# EAGLE design ciabatta (EAGLE 4.16)
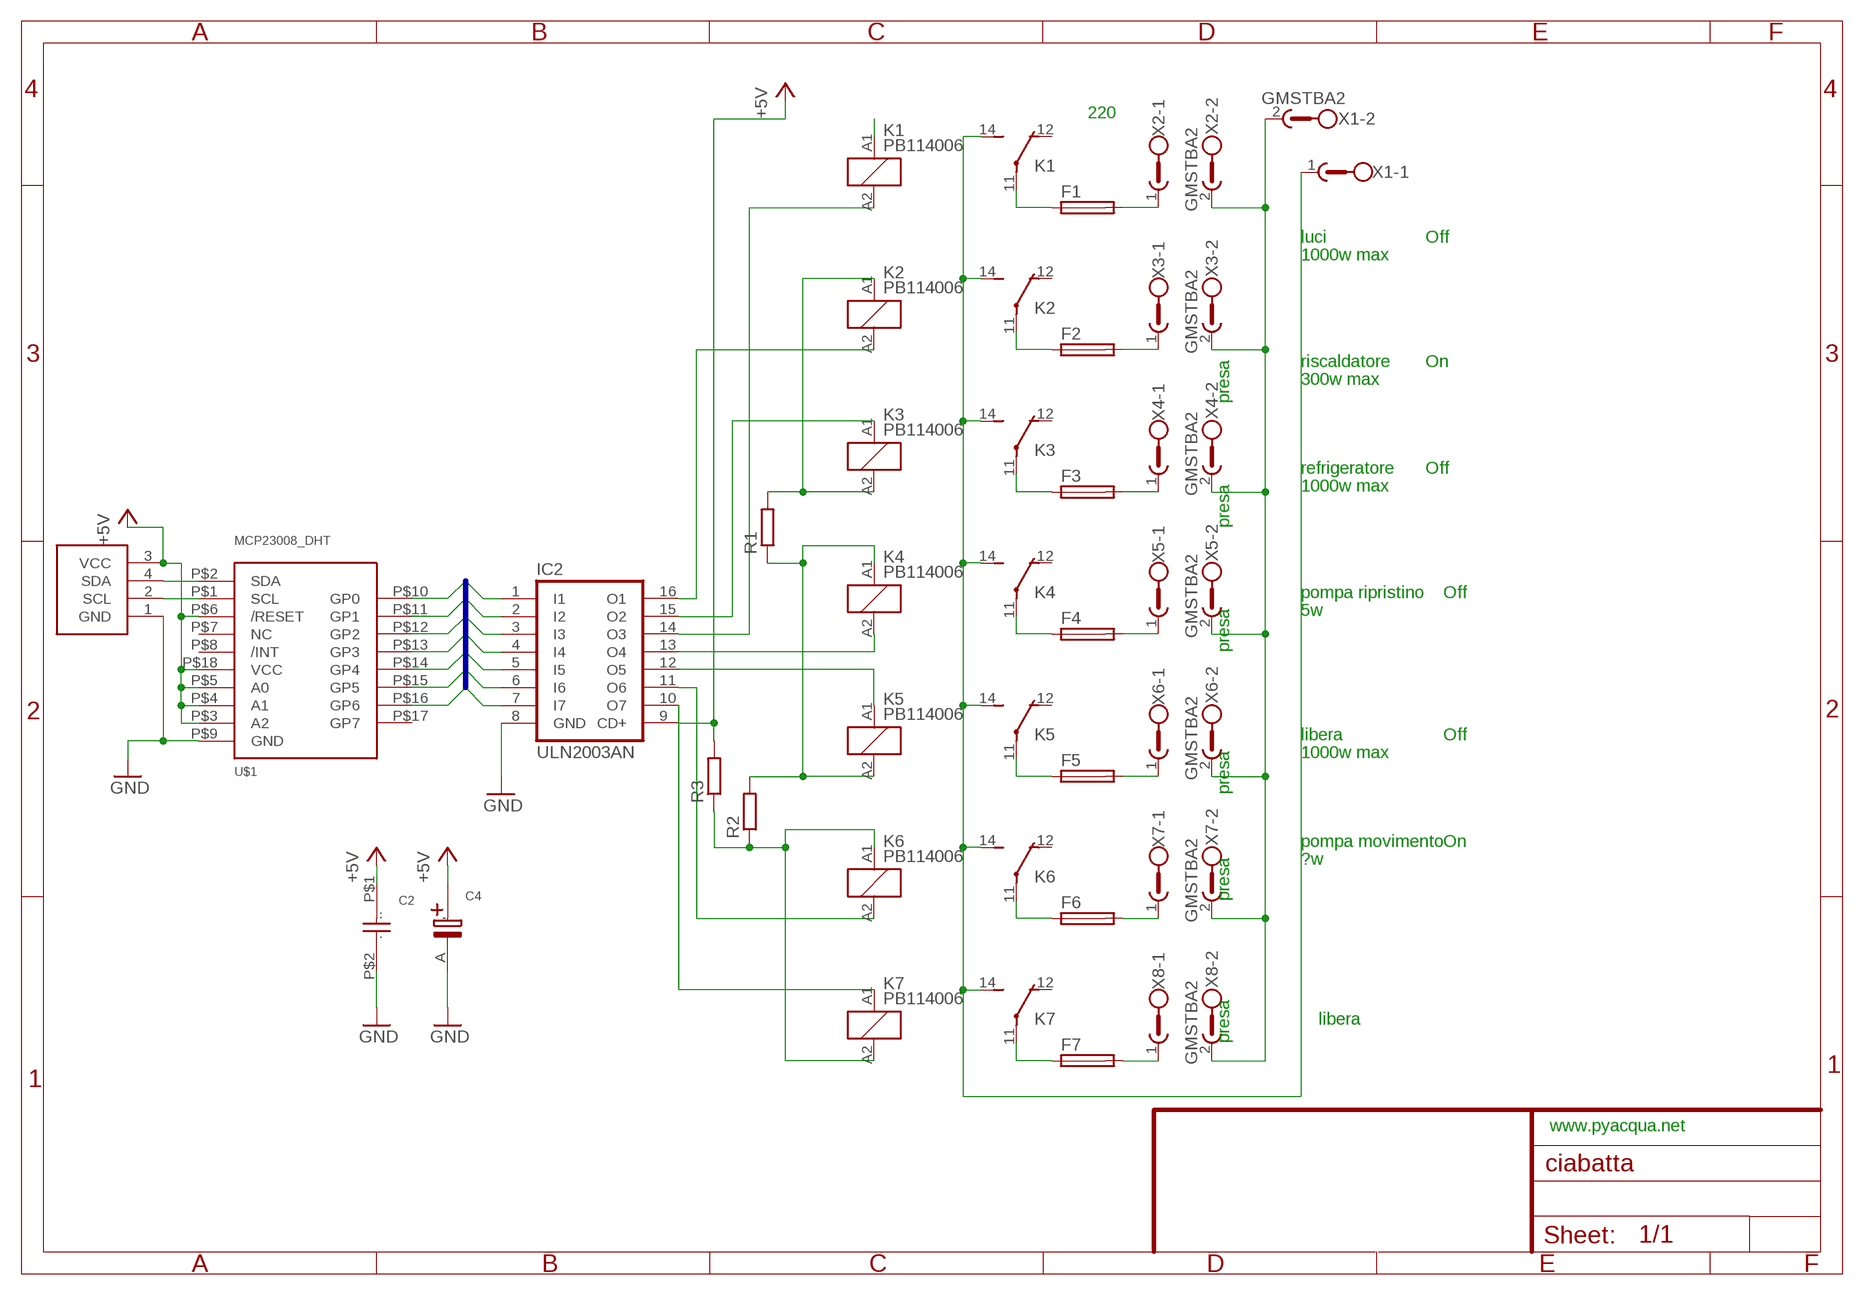
[diagram p0: schematic, sheet 1]

## Parts
C2  CAP_POLI  [CAP_POLI]
C4  CAP_ELET  [CAP_ELET]
F1  SH22,5A  [SH22,5A]
F2  SH22,5A  [SH22,5A]
F3  SH22,5A  [SH22,5A]
F4  SH22,5A  [SH22,5A]
F5  SH22,5A  [SH22,5A]
F6  SH22,5A  [SH22,5A]
F7  SH22,5A  [SH22,5A]
IC2  ULN2003AN  [DIL16]
K1  PB114006  [PB]
K2  PB114006  [PB]
K3  PB114006  [PB]
K4  PB114006  [PB]
K5  PB114006  [PB]
K6  PB114006  [PB]
K7  PB114006  [PB]
R1  R-EU_0207/15  [0207/15]
R2  R-EU_0207/15  [0207/15]
R3  R-EU_0207/7  [0207/7]
U$1  MCP23008_DHT  [MCP23008_DHT]
U$3  J-I2C  [J-I2C]
X1  GMSTBA2  [GMSTBA2]
X2  GMSTBA2  [GMSTBA2]
X3  GMSTBA2  [GMSTBA2]
X4  GMSTBA2  [GMSTBA2]
X5  GMSTBA2  [GMSTBA2]
X6  GMSTBA2  [GMSTBA2]
X7  GMSTBA2  [GMSTBA2]
X8  GMSTBA2  [GMSTBA2]

## Nets
+5V [vcc]: C2.P$1(.) C4.B(.) IC2.9(CD+) R3.2 U$1.P$3(A2) U$1.P$4(A1) U$1.P$5(A0) U$1.P$6(/RESET) U$1.P$18(VCC) U$3.3(VCC)
CH1: K2.A1 K3.A2 R1.2
CH2: IC2.16(O1) K2.A2
CH5: IC2.12(O5) K5.A1
CH6: IC2.11(O6) K6.A2
GND: C2.P$2(..) C4.A(') IC2.8(GND) U$1.P$9(GND) U$3.1(GND)
N$1 [220]: F3.1 K3.11(2:P)
N$2: K1.A1
N$3: U$1.P$1(SCL) U$3.2(SCL)
N$4: U$1.P$2(SDA) U$3.4(SDA)
N$5 [220]: K1.14(2:S) K2.14(2:S) K3.14(2:S) K4.14(2:S) K5.14(2:S) K6.14(2:S) K7.14(2:S) X1.1
N$6 [220]: F7.2 X8.1
N$7 [220]: F6.2 X7.1
N$8 [220]: F5.2 X6.1
N$9 [220]: F2.1 K2.11(2:P)
N$10 [220]: F4.2 X5.1
N$11 [220]: F1.1 K1.11(2:P)
N$12 [220]: F3.2 X4.1
N$13 [220]: F4.1 K4.11(2:P)
N$14 [220]: F2.2 X3.1
N$15 [220]: F5.1 K5.11(2:P)
N$16 [220]: F1.2 X2.1
N$18: IC2.10(O7) K7.A1
N$19 [220]: F7.1 K7.11(2:P)
N$20 [220]: F6.1 K6.11(2:P)
N$21: K6.A1 K7.A2 R2.1 R3.1
N$22: K4.A1 K5.A2 R1.1 R2.2
N$23 [220]: X1.2 X2.2 X3.2 X4.2 X5.2 X6.2 X7.2 X8.2
N$25: IC2.13(O4) K4.A2
N$26: IC2.14(O3) K1.A2
N$27: IC2.15(O2) K3.A1
OUT1: IC2.7(I7) U$1.P$10(GP0)
OUT2: IC2.6(I6) U$1.P$11(GP1)
OUT3: IC2.5(I5) U$1.P$12(GP2)
OUT4: IC2.4(I4) U$1.P$13(GP3)
OUT5: IC2.3(I3) U$1.P$14(GP4)
OUT6: IC2.2(I2) U$1.P$15(GP5)
OUT7: IC2.1(I1) U$1.P$16(GP6)
Unconnected: K1.12(2:O) K2.12(2:O) K3.12(2:O) K4.12(2:O) K5.12(2:O) K6.12(2:O) K7.12(2:O) U$1.P$7(NC) U$1.P$8(/INT) U$1.P$17(GP7)

## Buses
OUT[1..7]

## Notes on the sheet
- 220
- luci | Off
- 1000w max
- riscaldatore | On
- 300w max
- presa
- refrigeratore | Off
- 1000w max
- presa
- pompa ripristino | Off
- 5w
- presa
- libera | Off
- 1000w max
- presa
- pompa movimento | On
- ?w
- presa
- libera
- presa
- www.pyacqua.net

## Library data of the parts
C2 = aggiunte:CAP_POLI: Condensatore non elett passo 5.08 mm (2 x 2.54)
C4 = aggiunte:CAP_ELET: Condensatore elett. passo 2.54 mm
F1-F7 = fuse:SH22,5A: FUSE HOLDER grid 22,5mm, isolated cap OGN0031 8201, Schurter (Buerklin)
IC2 = uln-udn:ULN2003A: DRIVER ARRAY
K1-K7 = relay:PB?14*: Miniature Power PCB Relay SCHRACK 1pole 10 A Source: http://www.schrack.com/.. 5846.pdf
R1-R3 = rcl:R-EU_: RESISTOR, European symbol
U$1 = aggiunte:MCP23008_DHT: MCP23008 I2C EXPANDER 8 Ch
U$3 = aggiunte:J-I2C: connettore 4polare telefonico usatro x i2c
X1-X8 = con-phoenix-508:GMSTBA2: PHOENIX

## Net classes
0 signal: width 0.508 mm
1 220: width 2.54 mm
2 signal2: width 0.508 mm
3 vcc: width 1.016 mm
4 smd: width 0.203 mm

## Board
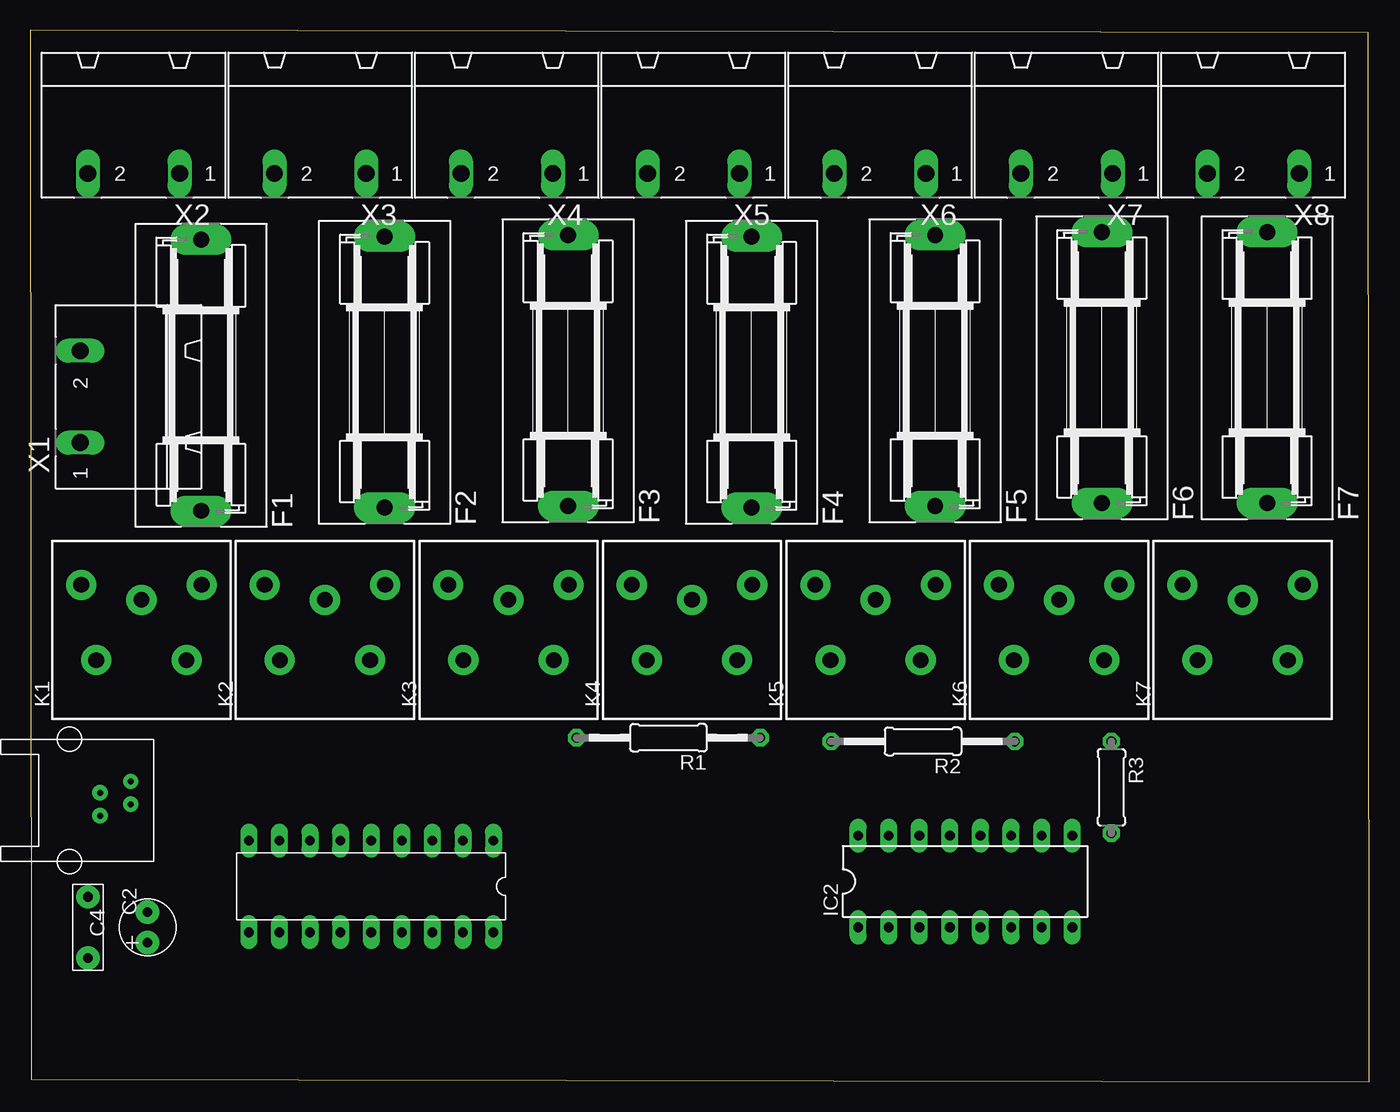
[diagram p1: board, top side]
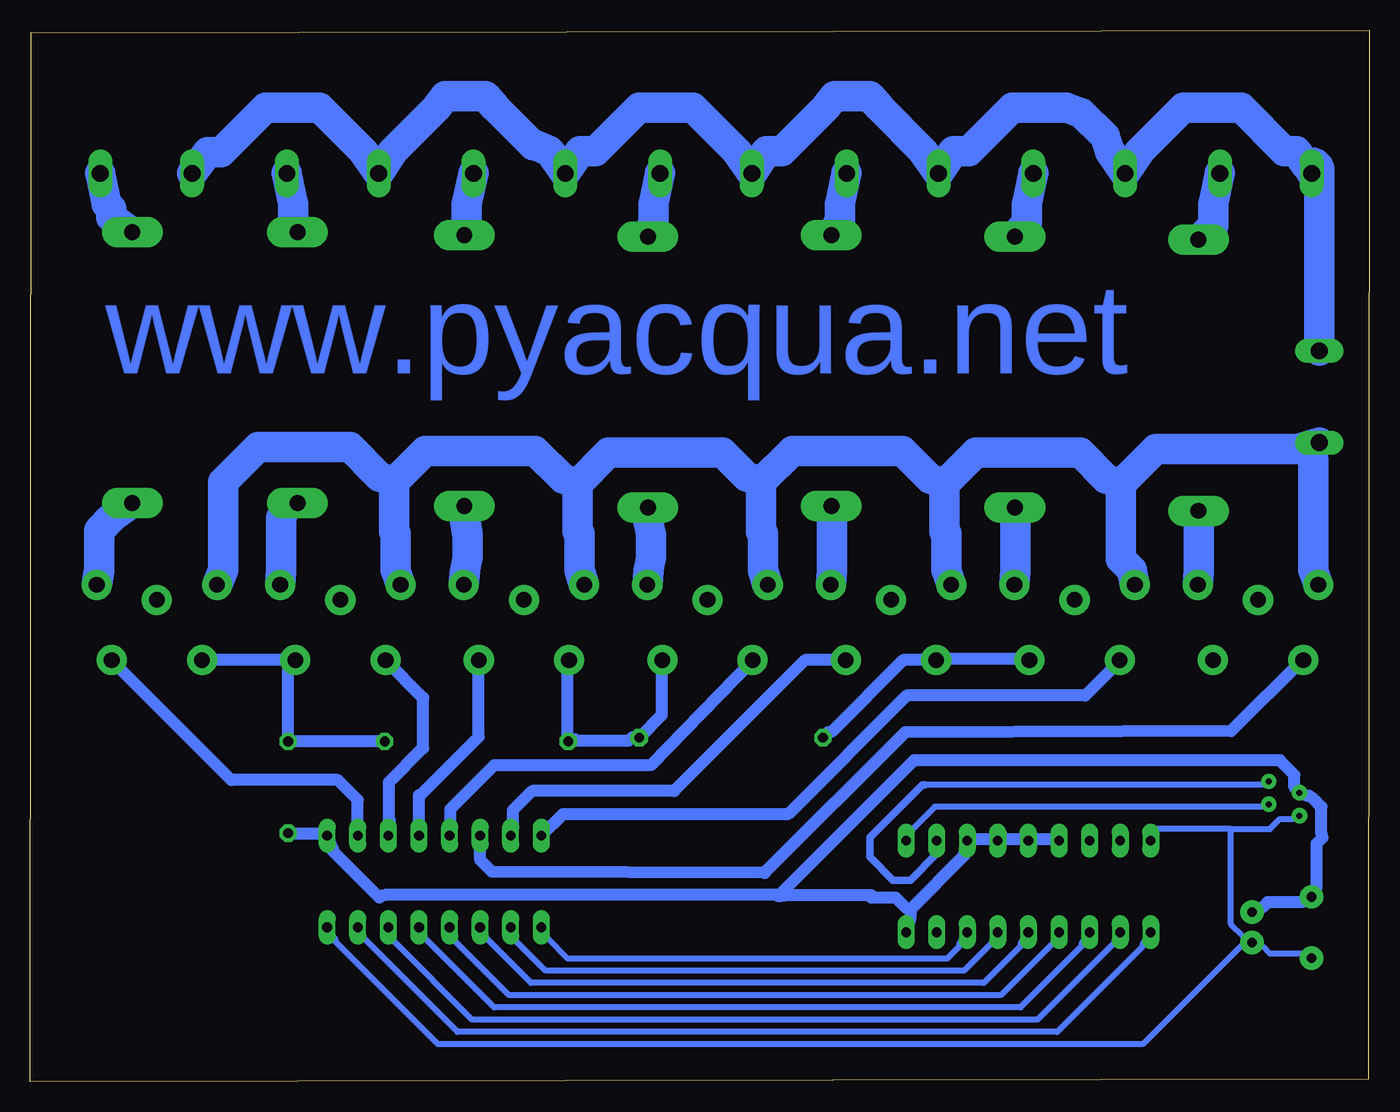
[diagram p2: board, bottom side, seen from below]

Size 111.21 x 87.33 mm. Coordinates in mm from the lower left corner, seen from the top.
Outline: 0.1,0.2 111.21,0 111.13,87.12 0,87.33 0.1,0.2
Copper layers (1*16): Top 0.035mm / dielectric 1.5mm / Bottom 0.035mm
Design rules "mio2": minimum track width 100mil, minimum drill 12mil, track to track 80mil, track to pad 80mil, pad to pad 80mil, via to via 80mil, smd to smd 80mil, copper to edge 100mil, drill to drill 8mil, minimum pad ring 12mil, minimum via ring 12mil, stop-mask expansion 4mil, vias tented up to drill 0mil, thermal gap 10mil
tRestrict: area 4.8,20.4 to 9.9,26.8; area 2.3,30.6 to 107.7,43.3
bRestrict: area 4.7,36.3 to 44.4,39.1

### Footprints (pad centres in the part's own frame; a part is rotated, then mirrored left to right if it is on the bottom)
CAP_POLI = drill 0.8 pad 1.93 round: P$1 -5.08,0; P$2 0,0
CAP_ELET = drill 0.8 pad 1.93 round: A -2.54,0; B 0,0
SH22,5A = drill 1.321 pad 2.54 long: 1 -11.252,0; 2 11.252,0
DIL16 = drill 0.813 long: 1 -8.89,-3.81; 2 -6.35,-3.81; 3 -3.81,-3.81; 4 -1.27,-3.81; 5 1.27,-3.81; 6 3.81,-3.81; 7 6.35,-3.81; 8 8.89,-3.81; 9 8.89,3.81; 10 6.35,3.81; 11 3.81,3.81; 12 1.27,3.81; 13 -1.27,3.81; 14 -3.81,3.81; 15 -6.35,3.81; 16 -8.89,3.81
PB = drill 1.3 pad 2.5 round: 11 3.81,-5; 12 2.56,0; 14 3.81,5; A1 -2.44,-3.75; A2 -2.44,3.75
0207/15 = drill 0.813 octagon: 1 -7.62,0; 2 7.62,0
0207/7 = drill 0.813 octagon: 1 -3.81,0; 2 3.81,0
MCP23008_DHT = drill 0.8 long: P$1 0,0; P$2 2.54,0; P$3 5.08,0; P$4 7.62,0; P$5 10.16,0; P$6 12.7,0; P$7 15.24,0; P$8 17.78,0; P$9 20.32,0; P$10 20.32,7.62; P$11 17.78,7.62; P$12 15.24,7.62; P$13 12.7,7.62; P$14 10.16,7.62; P$15 7.62,7.62; P$16 5.08,7.62; P$17 2.54,7.62; P$18 0,7.62
J-I2C = drill 0.5 pad 1.27 round: 1 -2.54,-0.635; 2 0,0.318; 3 -2.54,1.27; 4 0,2.223
GMSTBA2 = drill 1.397 long: 1 -3.81,5.08; 2 3.81,5.08

### Placement (x,y rotation side)
C2  4.8,10.27 270 top
C4  9.75,14.08 90 top
F1  14.19,58.66 90 top
F2  29.43,58.92 90 top
F3  44.67,59.04 90 top
F4  59.91,58.92 90 top
F5  75.15,59.04 90 top
F6  89,59.3 90 top
F7  102.71,59.3 90 top
IC2  77.64,16.62 0 top
K1  9.24,37.45 90 top
K2  24.48,37.45 90 top
K3  39.72,37.45 90 top
K4  54.96,37.45 90 top
K5  70.2,37.45 90 top
K6  85.44,37.45 90 top
K7  100.68,37.45 90 top
R1  53,28.56 180 top
R2  74.14,28.26 180 top
R3  89.78,24.45 270 top
U$1  38.48,20.03 180 top
U$2  [DINA4_P]  -32.34,-64.15 0 top  (outside the outline)
U$3  8.35,22.72 0 top
X1  9.24,56.88 90 top
X2  8.61,80.51 180 top
X3  24.1,80.51 180 top
X4  39.59,80.51 180 top
X5  55.09,80.51 180 top
X6  70.58,80.51 180 top
X7  86.08,80.51 180 top
X8  101.57,80.51 180 top

### Tracks (layer width: path | path; a pad name or v marks a point on that pad's centre or on a via)
+5V
  Bottom 1.016: C4.B 8.86,14.49 8.45,14.9 5.61,14.9 C2.P$1 4.39,16.22 4.39,19.77 3.88,20.28 3.98,20.59 3.98,22.82 4.59,23.43 5,23.74 5.2,23.74 U$3.3 6.22,24.45 6.22,25.46 7.44,26.68 37.82,26.68 49.09,15.41 48.18,15.51 | U$1.P$6 26.33,20.18 27.76,20.18 U$1.P$5 28.98,20.18 30.2,20.18 U$1.P$4 31.41,20.18 32.84,20.18 U$1.P$3 33.65,18.76 38.12,14.29 | 38.12,14.29 38.12,13.68 U$1.P$18 | 38.12,14.29 38.53,14.49 39.34,15.3 41.37,15.3 41.37,15.51 48.18,15.51 | R3.2 89.12,20.59 87.09,20.59 IC2.9 86.08,19.37 86.08,19.16 82.21,15.3 81.76,15.51 48.18,15.51
CH1
  Bottom 1.016: K2.A1 28.33,35.12 35.87,35.12 K3.A2 38.73,35.01 44.72,29.02 44.93,29.02 R1.2 45.54,28.41
CH2
  Bottom 1.016: IC2.16 66.97,22.21 48.28,22.21 38.42,32.07 23.59,32.07 20.65,35.01 | 20.65,35.01 20.64,35.01 | K2.A2 20.65,35.01
CH5
  Bottom 1.016: IC2.12 78.91,23.79 78.81,23.79 73.95,28.65 K5.A1
CH6
  Bottom 0.61: IC2.11 81.15,21.76
  Bottom 1.016: K6.A2 78.56,31.88 78.56,27.7 81.4,24.85 81.4,20.49 IC2.11
GND
  Bottom 0.508: C2.P$2 5.61,10.63 8.25,10.63 8.86,11.24 C4.A | 11.5,20.99 17.6,20.99 U$1.P$9 | 11.5,20.99 8.25,20.99 7.44,21.81 6.42,21.81 U$3.1 | IC2.8 85.87,11.85 85.87,11.65 77.34,3.11 18.82,3.11 10.69,11.24 C4.A | 11.5,20.99 11.5,13.07 10.48,12.05 C4.A
N$1
  Bottom 2.54: K3.11 44.62,42.43 44.62,46.6 F3.1
N$3
  Bottom 0.508: U$3.2 8.86,22.82 36.09,22.82 37.92,20.99 U$1.P$1
N$4
  Bottom 0.508: 36.9,24.65 8.86,24.65 U$3.4
  Bottom 0.61: U$1.P$2 35.94,18.91 38.12,16.73 39.54,16.73 41.47,18.66 41.47,20.28 37.1,24.65 36.9,24.65
N$5
  Bottom 2.54: 20.64,49.64 17.75,52.54 6.01,52.54 4.99,52.83 | 20.64,49.64 20.64,43.4 19.73,42.48 K2.14 | 4.99,52.83 X1.1 | K1.14 4.64,42.48 4.64,51.63 4.99,52.83 | 35.28,49.64 35.28,45.68 35.12,45.53 35.12,42.48 K3.14 | 35.28,49.64 32.68,52.24 24,52.24 21.86,50.1 20.64,49.64 | 50.52,49.8 50.52,45.68 50.36,45.53 50.36,42.48 K4.14 | 50.52,49.8 47.92,52.39 38.78,52.39 36.49,50.1 35.28,49.64 | 65.76,49.64 65.76,45.68 65.6,45.53 65.6,42.48 K5.14 | 65.76,49.64 63.16,52.24 53.72,52.24 51.73,50.25 50.52,49.8 | 81,49.8 81,45.68 80.84,45.53 80.84,42.48 K6.14 | 81,49.8 78.4,52.39 69.26,52.39 66.97,50.1 65.76,49.64 | K7.14 95.17,42.48 95.17,49.8 92.27,52.69 84.65,52.69 82.21,50.25 81,49.8
N$6
  Bottom 2.54: F7.2 104.46,71.78 104.46,72.48 104.86,72.88 X8.1
N$7
  Bottom 2.54: F6.2 89.36,71.78 89.36,72.88 X7.1
N$8
  Bottom 2.54: F5.2 74.96,71.48 74.96,72.88 X6.1
N$9
  Bottom 2.54: K2.11 29.38,42.43 29.38,47.61 F2.1
N$10
  Bottom 2.54: F4.2 59.46,71.38 59.46,72.88 X5.1
N$11
  Bottom 2.54: K1.11 14.14,42.43 14.14,46.19 F1.1
N$12
  Bottom 2.54: F3.2 43.96,71.48 43.96,72.88 X4.1
N$13
  Bottom 2.54: K4.11 59.86,42.43 59.66,43.55 59.66,45.38 59.86,46.49 F4.1
N$14
  Bottom 2.54: F2.2 28.46,71.38 28.46,72.88 X3.1
N$15
  Bottom 2.54: K5.11 75.1,42.43 74.9,43.55 74.9,45.38 75.1,46.6 F5.1
N$16
  Bottom 2.54: F1.2 12.96,71.08 12.96,72.88 X2.1
N$18
  Bottom 1.016: IC2.10 83.99,23.38 85.67,25.06 94.51,25.06 104.43,34.98 K7.A1
N$19
  Bottom 2.54: K7.11 105.48,42.43 105.48,45.78 104.46,46.8 F7.1
N$20
  Bottom 2.54: K6.11 90.34,42.43 90.34,46.8 89.83,48.02 F6.1
N$21
  Bottom 1.016: 96.94,35.01 K7.A2 | 96.94,35.01 K6.A1 88.92,35.01 | 96.94,35.01 97.15,35.22 | 88.92,35.01 88.82,35.12 | 88.92,35.01 89.78,34.15 R3.1 89.63,28.41 89.48,28.26 R2.1
N$22
  Bottom 0.61: R1.1 61.18,28.61 | R2.2 65.91,28.61
  Bottom 1.016: K4.A1 58.74,34.98 58.74,30.44 R1.1 | 61.18,28.61 61.49,28.31 66.47,28.31 R2.2 66.57,28.31 66.57,34.89 K5.A2
N$23
  Bottom 2.54: X8.2 96.46,77.18 95.36,77.18 91.66,80.88 87.16,80.88 83.56,77.28 X7.2 81.06,77.28 77.46,80.88 76.73,81.85 73.38,81.85 72.56,80.88 69.46,77.78 69.26,77.78 68.06,77.28 X6.2 65.56,77.28 64.26,77.28 60.66,80.88 56.16,80.88 52.56,77.28 X5.2 50.06,77.28 48.76,77.28 45.16,80.88 44.42,81.85 41.47,81.85 40.66,80.88 37.06,77.28 X4.2 34.56,77.28 33.26,77.28 29.66,80.88 25.16,80.88 23.9,80.43 21.97,78.5 21.56,77.28 X3.2 19.06,77.28 15.46,80.88 10.66,80.88 7.06,77.28 6.06,77.28 5.21,76.03 | 5.21,76.03 X2.2 | 5.21,76.03 5.08,76.03 arc-90 4.8,76.31 arc90 4.16,75.68 X1.2
N$25
  Bottom 1.016: IC2.13 76.32,20.49 76.32,22.62 72.66,26.28 59.66,26.28 51.12,35.01 K4.A2
N$26
  Bottom 1.016: IC2.14 73.83,18.4 72.87,17.44 50.21,17.34 38.53,29.02 11.5,29.12 5.51,35.12 5.49,35.1 K1.A2
N$27
  Bottom 1.016: K3.A1 46.86,35.01 57.73,24.14 69.51,24.14 71.14,22.52 71.14,20.59 IC2.15
OUT1
  Bottom 0.508: U$1.P$10 18.82,11.44 18.82,11.24 25.93,4.13 75.71,4.13 83.43,11.85 IC2.7
OUT2
  Bottom 0.508: U$1.P$11 21.25,11.44 27.55,5.14 74.49,5.14 81,11.65 IC2.6
OUT3
  Bottom 0.508: U$1.P$12 23.9,11.44 23.9,11.24 28.98,6.16 72.66,6.16 78.35,11.85 IC2.5
OUT4
  Bottom 0.508: U$1.P$13 26.33,11.44 30.6,7.18 71.44,7.18 75.92,11.65 IC2.4
OUT5
  Bottom 0.508: U$1.P$14 28.98,11.44 28.98,11.24 32.02,8.19 69.62,8.19 73.27,11.85 IC2.3
OUT6
  Bottom 0.508: U$1.P$15 31.41,11.44 33.65,9.21 68.4,9.21 70.84,11.65 IC2.2
OUT7
  Bottom 0.508: U$1.P$16 34.06,11.44 34.06,11.24 35.07,10.22 66.57,10.22 68.19,11.85 IC2.1

### Text on the board
Bottom: www.pyacqua.net